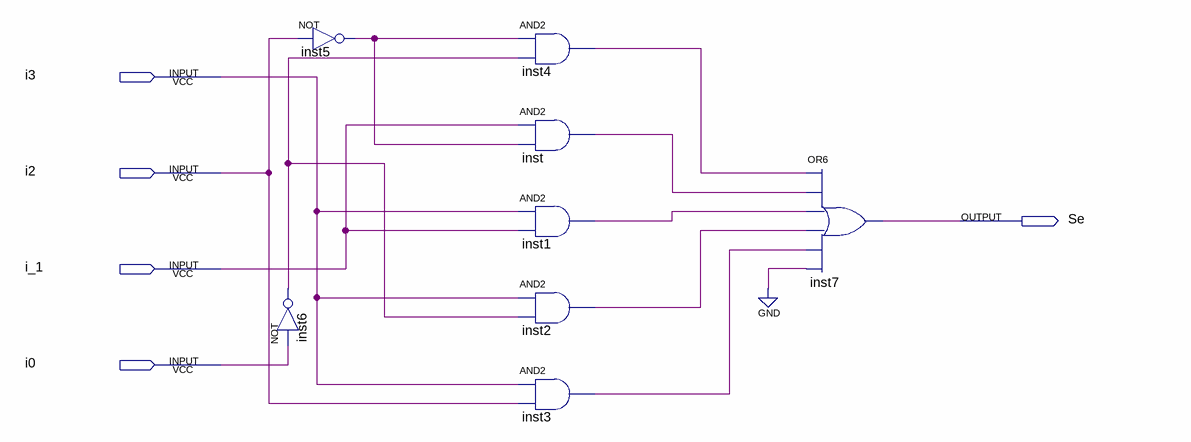
[diagram p0: schematic sheet]
// Quartus schematic lab05_c_top.bdf as structural Verilog: 8 symbols, 5 pins
module lab05_c_top (
  input  i3,
  input  i2,
  input  i_1,
  input  i0,
  output Se
);

  wire inst1_out, inst2_out, inst3_out, inst4_out, inst5_out, inst6_out, inst_out;

  not inst6 (inst6_out, i0);
  not inst5 (inst5_out, i2);
  and inst4 (inst4_out, inst5_out, inst6_out);
  and inst (inst_out, i_1, inst5_out);
  and inst1 (inst1_out, i3, i_1);
  and inst2 (inst2_out, i3, inst6_out);
  and inst3 (inst3_out, i3, i2);
  or inst7 (Se, inst4_out, inst_out, inst1_out, inst2_out, inst3_out, 1'b0);
endmodule
